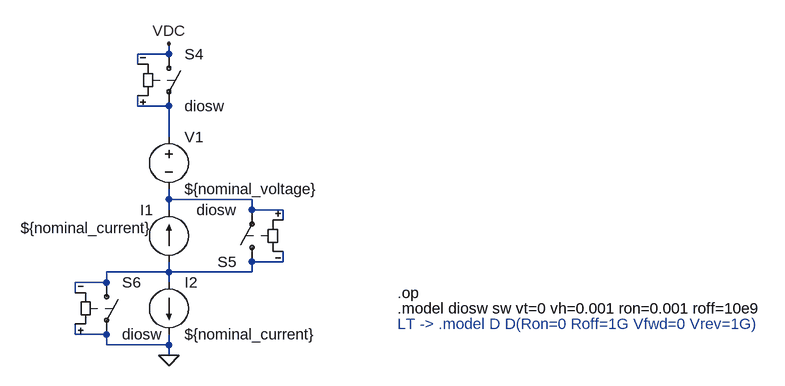
[diagram p0: schematic Generator.asc]
Generator.asc, the LTspice schematic file:
Version 4
SHEET 1 1272 680
WIRE -80 -48 -80 -64
WIRE -80 -48 -128 -48
WIRE -128 -32 -128 -48
WIRE -128 32 -128 16
WIRE -80 32 -128 32
WIRE -80 80 -80 32
WIRE -80 176 -80 160
WIRE 48 176 -80 176
WIRE -80 192 -80 176
WIRE 48 192 48 176
WIRE 96 192 48 192
WIRE 96 208 96 192
WIRE 96 272 96 256
WIRE 96 272 48 272
WIRE -80 288 -80 272
WIRE -80 288 -176 288
WIRE 48 288 48 272
WIRE 48 288 -80 288
WIRE -176 304 -176 288
WIRE -176 304 -224 304
WIRE -80 304 -80 288
WIRE -224 320 -224 304
WIRE -224 384 -224 368
WIRE -176 384 -224 384
WIRE -176 400 -176 384
WIRE -80 400 -80 384
WIRE -80 400 -176 400
WIRE -80 416 -80 400
FLAG -80 416 0
FLAG -80 -64 VDC
SYMBOL current -80 272 R180
WINDOW 0 24 80 Left 2
WINDOW 3 24 52 Left 2
WINDOW 123 0 0 Left 0
WINDOW 39 0 0 Left 0
SYMATTR InstName I1
SYMATTR Value ${nominal_current}
SYMBOL voltage -80 64 R0
WINDOW 123 0 0 Left 0
WINDOW 39 0 0 Left 0
SYMATTR InstName V1
SYMATTR Value ${nominal_voltage}
SYMBOL current -80 304 R0
WINDOW 123 0 0 Left 0
WINDOW 39 0 0 Left 0
SYMATTR InstName I2
SYMATTR Value ${nominal_current}
SYMBOL sw -80 -64 R0
SYMATTR InstName S4
SYMATTR Value diosw
SYMBOL sw 48 288 R180
SYMATTR InstName S5
SYMATTR Value diosw
SYMBOL sw -176 288 R0
SYMATTR InstName S6
SYMATTR Value diosw
TEXT 272 320 Left 2 !.op
TEXT 272 344 Left 2 !.model diosw sw vt=0 vh=0.001 ron=0.001 roff=10e9
TEXT 272 368 Left 2 ;LT -> .model D D(Ron=0 Roff=1G Vfwd=0 Vrev=1G)

The netlist it stands for:
* Generator.asc
I1 N003 N002 ${nominal_current}
V1 N001 N002 ${nominal_voltage}
I2 N003 0 ${nominal_current}
S4 VDC N001 N001 VDC diosw
S5 N003 N002 N002 N003 diosw
S6 N003 0 0 N003 diosw
.op
.model diosw sw vt=0 vh=0.001 ron=0.001 roff=10e9
* LT -> .model D D(Ron=0 Roff=1G Vfwd=0 Vrev=1G)
.backanno
.end